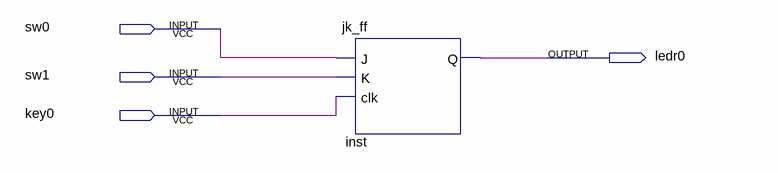
[diagram p0: schematic sheet]
// Quartus schematic jk_ff_tb.bdf as structural Verilog: 1 symbols, 4 pins
module jk_ff_tb (
  input  sw0,
  input  sw1,
  input  key0,
  output ledr0
);

  jk_ff inst (.J(sw0), .K(sw1), .clk(key0), .Q(ledr0));
endmodule
